# EAGLE design bcd_to_7segment (EAGLE 9.4.1)
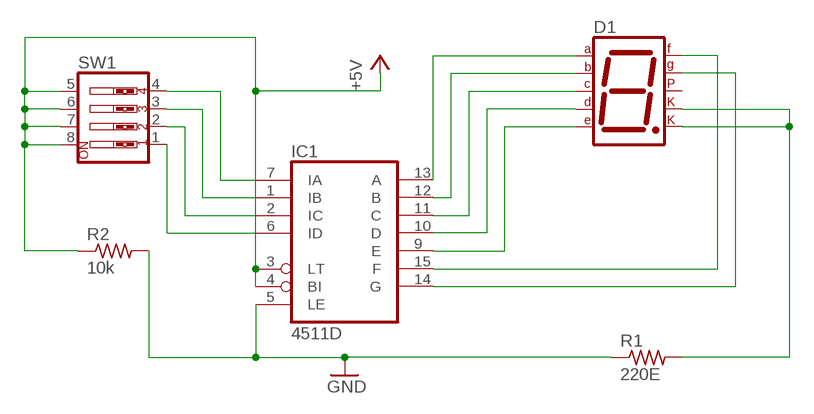
[diagram p0: schematic, sheet 1]

## Parts
D1  7SEG-CK  [7SEG-13]
IC1  4511D  [SO16]
R1  220E  R-US_R0603  [R0603]
R2  10k  R-US_R0603  [R0603]
SW1  SW_DIP-4  [EDG-04]

## Nets
+5V: IC1.3(LT) IC1.4(BI) R2.1 SW1.5 SW1.6 SW1.7 SW1.8
GND: IC1.5(LE) R1.1 R2.2
N$1: D1.7(A) IC1.13(A)
N$2: D1.6(B) IC1.12(B)
N$3: D1.4(C) IC1.11(C)
N$4: D1.2(D) IC1.10(D)
N$5: D1.1(E) IC1.9(E)
N$6: D1.10(G) IC1.14(G)
N$7: D1.9(F) IC1.15(F)
N$8: IC1.7(IA) SW1.4
N$9: IC1.1(IB) SW1.3
N$10: IC1.2(IC) SW1.2
N$11: IC1.6(ID) SW1.1
N$14: D1.3(CK1) D1.8(CK2) R1.2
Unconnected: D1.5(DP)

## Power pins joined to a net without a drawn wire
VDD: IC1.16(VDD)
VSS: IC1.8(VSS)

## Library data of the parts
D1 = special:7SEG-CK: 7-segment DISPLAY single cathode, 13 mm
IC1 = 45xx:4511: BCD to 7-segment LATCH/DECODER/DRIVER
R1 R2 = rcl:R-US_: RESISTOR, American symbol; SPICEPREFIX: R
SW1 = special:SW_DIP-4: DIP SWITCH

## Board
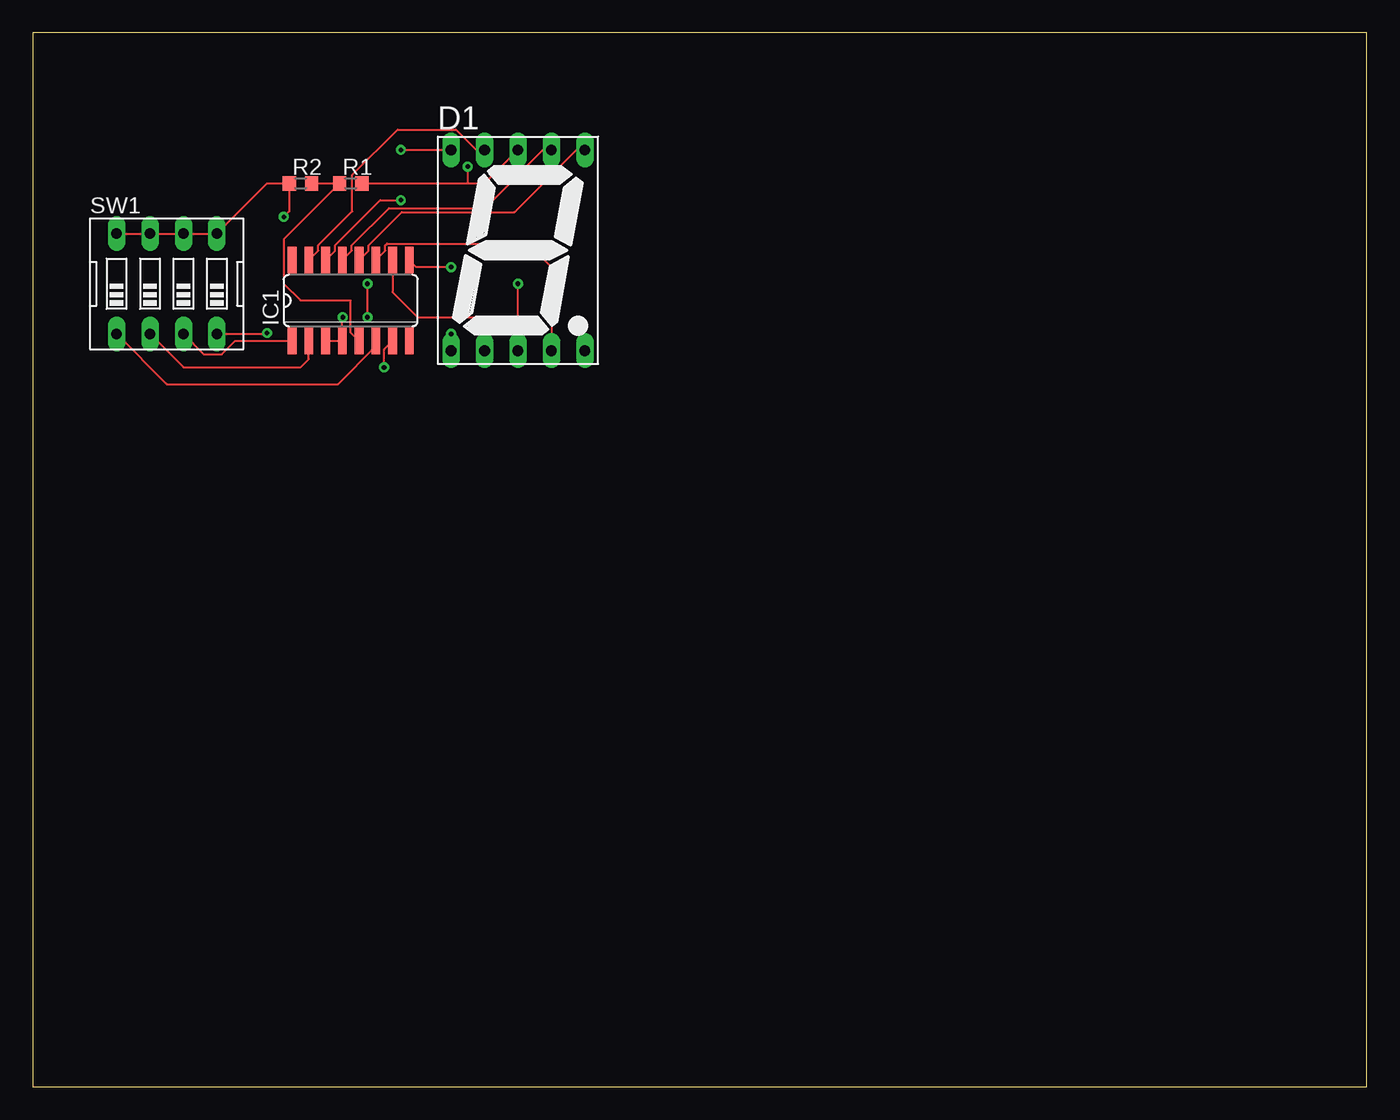
[diagram p1: board, top side]
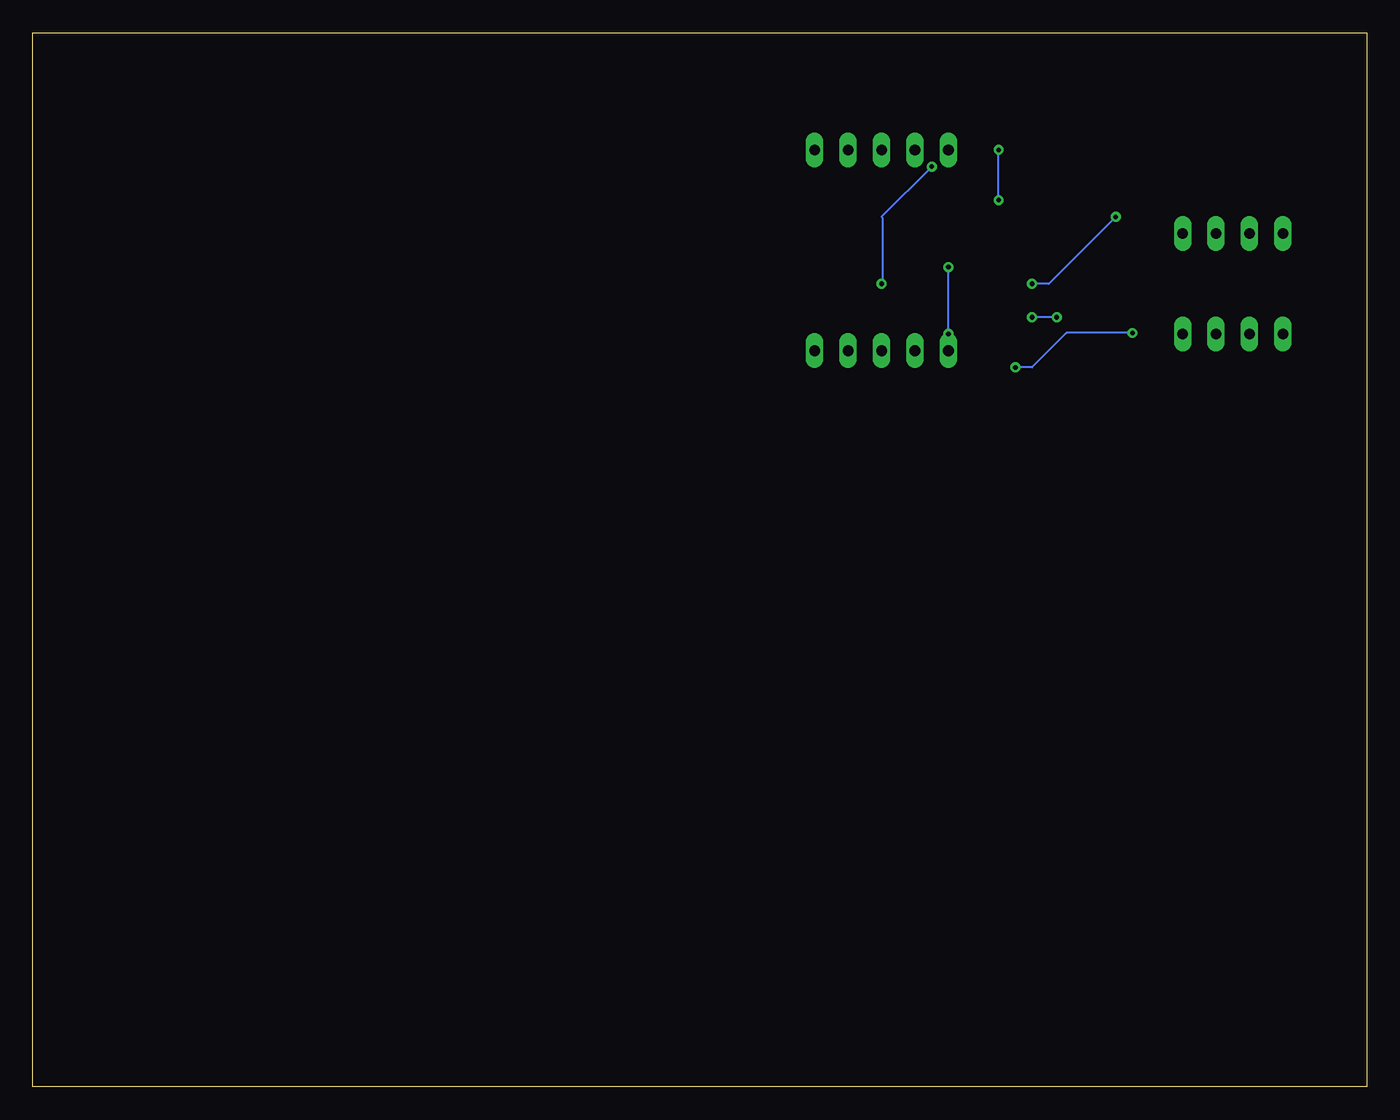
[diagram p2: board, bottom side, seen from below]

Size 101.27 x 80 mm. Coordinates in mm from the lower left corner, seen from the top.
Outline: 0,0 101.27,0 101.27,80 0,80 0,0
Copper layers (1*16): Top 0.035mm / dielectric 1.5mm / Bottom 0.035mm
Design rules "default": minimum track width 6mil, minimum drill 0.35mm, track to track 6mil, track to pad 6mil, pad to pad 6mil, via to via 6mil, smd to smd 6mil, copper to edge 40mil, drill to drill 6mil, minimum pad ring 10mil, minimum via ring 8mil, stop-mask expansion 4mil, vias tented up to drill 0mil, thermal gap 10mil

### Footprints (pad centres in the part's own frame; a part is rotated, then mirrored left to right if it is on the bottom)
7SEG-13 = drill 0.813 long: 1 -5.08,-7.62; 2 -2.54,-7.62; 3 0,-7.62; 4 2.54,-7.62; 5 5.08,-7.62; 6 5.08,7.62; 7 2.54,7.62; 8 0,7.62; 9 -2.54,7.62; 10 -5.08,7.62
SO16 = smd 0.66 x 2.032: 1 -4.445,-3.073; 2 -3.175,-3.073; 3 -1.905,-3.073; 4 -0.635,-3.073; 5 0.635,-3.073; 6 1.905,-3.073; 7 3.175,-3.073; 8 4.445,-3.073; 9 4.445,3.073; 10 3.175,3.073; 11 1.905,3.073; 12 0.635,3.073; 13 -0.635,3.073; 14 -1.905,3.073; 15 -3.175,3.073; 16 -4.445,3.073
R0603 = smd 1 x 1.1: 1 -0.85,0; 2 0.85,0
EDG-04 = drill 0.813 long: 1 -3.81,-3.81; 2 -1.27,-3.81; 3 1.27,-3.81; 4 3.81,-3.81; 5 3.81,3.81; 6 1.27,3.81; 7 -1.27,3.81; 8 -3.81,3.81

### Placement (x,y rotation side)
D1  36.83,63.5 0 top
IC1  24.13,59.69 0 top
R1  24.13,68.58 0 top
R2  20.32,68.58 0 top
SW1  10.16,60.96 0 top

### Tracks (layer width: path | path; a pad name or v marks a point on that pad's centre or on a via)
+5V  (via drill 0.35)
  Top 0.152: SW1.8 SW1.7 SW1.6 SW1.5 17.78,68.58 R2.1 19.47,66.46 v19.05,66.04 | v25.4,58.42 v25.4,60.96 | IC1.3 IC1.4 23.5,58.39 v23.52,58.42
  Bottom 0.152: v19.05,66.04 24.13,60.96 v25.4,60.96 | v23.52,58.42 v25.4,58.42
GND
  Top 0.152: R2.2 R1.1 19.05,64.35 19.05,60.96 20.32,59.69 24.13,59.69 24.13,57.25 IC1.5
N$1
  Top 0.152: IC1.13 24.21,63.48 24.21,63.87 27.04,66.7 34.33,66.7 38.75,71.12 D1.7
N$2
  Top 0.152: IC1.12 25.48,63.48 25.48,63.87 28,66.4 36.57,66.4 41.29,71.12 D1.6
N$3
  Top 0.152: IC1.11 26.75,63.48 26.75,63.87 26.88,64.01 37.59,64.01 39.37,62.23 D1.4
N$4
  Top 0.152: IC1.10 27.3,60.33 29.21,58.42 34.29,58.42 D1.2
N$5  (via drill 0.35)
  Top 0.152: D1.1 v31.75,57.15 | v31.75,62.23 29.11,62.23 IC1.9
  Bottom 0.152: v31.75,57.15 v31.75,62.23
N$6  (via drill 0.35)
  Top 0.152: IC1.14 22.94,63.48 22.94,63.87 26.37,67.31 v27.94,67.31 | v27.94,71.12 D1.10
  Bottom 0.152: v27.94,67.31 v27.94,71.12
N$7
  Top 0.152: IC1.15 21.67,63.48 21.67,63.87 24.25,66.46 24.25,69.22 27.7,72.67 32.12,72.67 33.67,71.12 D1.9
N$8  (via drill 0.35)
  Top 0.152: SW1.4 17.71,57.15 v17.78,57.22 | v26.67,54.61 26.67,55.98 IC1.7
  Bottom 0.152: v17.78,57.22 22.79,57.22 25.4,54.61 v26.67,54.61
N$9
  Top 0.152: IC1.1 15.35,56.62 14.34,55.6 12.98,55.6 SW1.3
N$10
  Top 0.152: SW1.2 11.43,54.61 20.32,54.61 20.95,55.24 IC1.2
N$11
  Top 0.152: SW1.1 10.16,53.34 23.16,53.34 26.04,56.22 IC1.6
N$14  (via drill 0.35)
  Top 0.152: R1.2 33.02,68.58 | 33.02,68.58 34.29,68.58 D1.8 | D1.3 v36.83,60.96 | v33.02,69.85 33.02,68.58
  Bottom 0.152: v33.02,69.85 36.83,66.04 36.78,65.99 36.78,60.96 v36.83,60.96